# EAGLE schematic rotaryEnc (EAGLE 9.1.2)
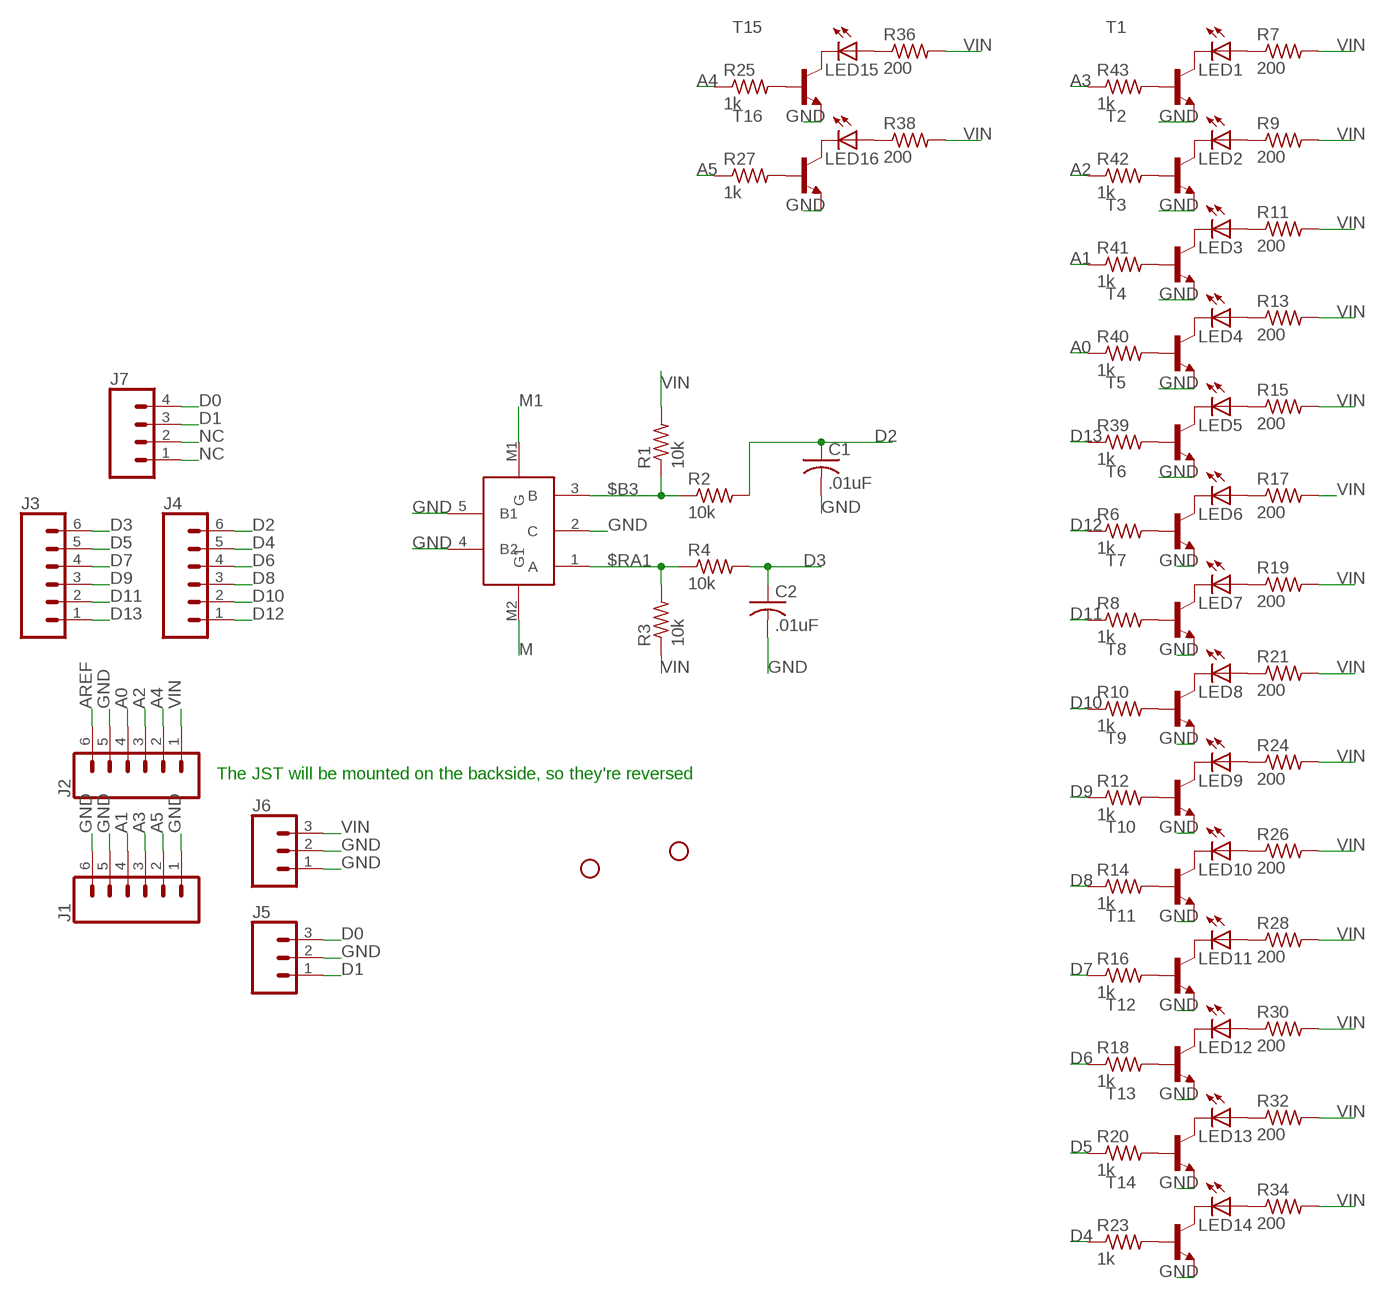
[diagram p0: schematic, sheet 1]

## Parts
C1  .01uF  C-USC1206K  [C1206K]
C2  .01uF  C-USC1206K  [C1206K]
H1  STAND-OFF  [STAND-OFF]
H2  STAND-OFF  [STAND-OFF]
J1  CONN_061.27MM  [1X06_1.27MM]
J2  CONN_061.27MM  [1X06_1.27MM]
J3  CONN_061.27MM  [1X06_1.27MM]
J4  CONN_061.27MM  [1X06_1.27MM]
J5  CONN_03JST-PTH-VERT  [JST-3-PTH-VERT]
J6  CONN_03JST-PTH-VERT  [JST-3-PTH-VERT]
J7  CONN_041.27MM  [1X04_1.27MM]
LED1  LEDCHIP-LED0805  [CHIP-LED0805]
LED2  LEDCHIP-LED0805  [CHIP-LED0805]
LED3  LEDCHIP-LED0805  [CHIP-LED0805]
LED4  LEDCHIP-LED0805  [CHIP-LED0805]
LED5  LEDCHIP-LED0805  [CHIP-LED0805]
LED6  LEDCHIP-LED0805  [CHIP-LED0805]
LED7  LEDCHIP-LED0805  [CHIP-LED0805]
LED8  LEDCHIP-LED0805  [CHIP-LED0805]
LED9  LEDCHIP-LED0805  [CHIP-LED0805]
LED10  LEDCHIP-LED0805  [CHIP-LED0805]
LED11  LEDCHIP-LED0805  [CHIP-LED0805]
LED12  LEDCHIP-LED0805  [CHIP-LED0805]
LED13  LEDCHIP-LED0805  [CHIP-LED0805]
LED14  LEDCHIP-LED0805  [CHIP-LED0805]
LED15  LEDCHIP-LED0805  [CHIP-LED0805]
LED16  LEDCHIP-LED0805  [CHIP-LED0805]
R1  10k  R-US_R0805  [R0805]
R2  10k  R-US_R0805  [R0805]
R3  10k  R-US_R0805  [R0805]
R4  10k  R-US_R0805  [R0805]
R6  1k  R-US_R0805  [R0805]
R7  200  R-US_R0805  [R0805]
R8  1k  R-US_R0805  [R0805]
R9  200  R-US_R0805  [R0805]
R10  1k  R-US_R0805  [R0805]
R11  200  R-US_R0805  [R0805]
R12  1k  R-US_R0805  [R0805]
R13  200  R-US_R0805  [R0805]
R14  1k  R-US_R0805  [R0805]
R15  200  R-US_R0805  [R0805]
R16  1k  R-US_R0805  [R0805]
R17  200  R-US_R0805  [R0805]
R18  1k  R-US_R0805  [R0805]
R19  200  R-US_R0805  [R0805]
R20  1k  R-US_R0805  [R0805]
R21  200  R-US_R0805  [R0805]
R23  1k  R-US_R0805  [R0805]
R24  200  R-US_R0805  [R0805]
R25  1k  R-US_R0805  [R0805]
R26  200  R-US_R0805  [R0805]
R27  1k  R-US_R0805  [R0805]
R28  200  R-US_R0805  [R0805]
R30  200  R-US_R0805  [R0805]
R32  200  R-US_R0805  [R0805]
R34  200  R-US_R0805  [R0805]
R36  200  R-US_R0805  [R0805]
R38  200  R-US_R0805  [R0805]
R39  1k  R-US_R0805  [R0805]
R40  1k  R-US_R0805  [R0805]
R41  1k  R-US_R0805  [R0805]
R42  1k  R-US_R0805  [R0805]
R43  1k  R-US_R0805  [R0805]
T1  BCX56-NPN-SOT89-BCE  [SOT89-BCE]
T2  BCX56-NPN-SOT89-BCE  [SOT89-BCE]
T3  BCX56-NPN-SOT89-BCE  [SOT89-BCE]
T4  BCX56-NPN-SOT89-BCE  [SOT89-BCE]
T5  BCX56-NPN-SOT89-BCE  [SOT89-BCE]
T6  BCX56-NPN-SOT89-BCE  [SOT89-BCE]
T7  BCX56-NPN-SOT89-BCE  [SOT89-BCE]
T8  BCX56-NPN-SOT89-BCE  [SOT89-BCE]
T9  BCX56-NPN-SOT89-BCE  [SOT89-BCE]
T10  BCX56-NPN-SOT89-BCE  [SOT89-BCE]
T11  BCX56-NPN-SOT89-BCE  [SOT89-BCE]
T12  BCX56-NPN-SOT89-BCE  [SOT89-BCE]
T13  BCX56-NPN-SOT89-BCE  [SOT89-BCE]
T14  BCX56-NPN-SOT89-BCE  [SOT89-BCE]
T15  BCX56-NPN-SOT89-BCE  [SOT89-BCE]
T16  BCX56-NPN-SOT89-BCE  [SOT89-BCE]
U$1  EC11  [EC12]

## Nets
$B3: R1.1 R2.1 U$1.3(B)
$RA1: R3.2 R4.1 U$1.1(A)
A0: J2.4 R40.1
A1: J1.4 R41.1
A2: J2.3 R42.1
A3: J1.3 R43.1
A4: J2.2 R25.1
A5: J1.2 R27.1
AREF: J2.6
D0: J5.3 J7.4
D1: J5.1 J7.3
D2: C1.1 J4.6 R2.2
D3: C2.1 J3.6 R4.2
D4: J4.5 R23.1
D5: J3.5 R20.1
D6: J4.4 R18.1
D7: J3.4 R16.1
D8: J4.3 R14.1
D9: J3.3 R12.1
D10: J4.2 R10.1
D11: J3.2 R8.1
D12: J4.1 R6.1
D13: J3.1 R39.1
GND: C1.2 C2.2 J1.1 J1.5 J1.6 J2.5 J5.2 J6.1 J6.2 T1.E T2.E T3.E T4.E T5.E T6.E T7.E T8.E T9.E T10.E T11.E T12.E T13.E T14.E T15.E T16.E U$1.2(C) U$1.4(B2) U$1.5(B1)
M: U$1.M2(G1)
M1: U$1.M1(G)
N$5: R43.2 T1.B
N$6: LED1.C T1.C
N$7: LED1.A R7.1
N$8: LED2.C T2.C
N$9: LED2.A R9.1
N$10: R42.2 T2.B
N$11: LED3.C T3.C
N$12: LED3.A R11.1
N$13: R41.2 T3.B
N$14: LED4.C T4.C
N$15: LED4.A R13.1
N$16: R40.2 T4.B
N$17: LED5.C T5.C
N$18: LED5.A R15.1
N$19: R39.2 T5.B
N$20: LED6.C T6.C
N$21: LED6.A R17.1
N$22: R6.2 T6.B
N$23: LED7.C T7.C
N$24: LED7.A R19.1
N$25: R8.2 T7.B
N$26: LED8.C T8.C
N$27: LED8.A R21.1
N$28: R10.2 T8.B
N$29: LED9.C T9.C
N$30: LED9.A R24.1
N$31: R12.2 T9.B
N$32: LED10.C T10.C
N$33: LED10.A R26.1
N$34: R14.2 T10.B
N$35: LED11.C T11.C
N$36: LED11.A R28.1
N$37: R16.2 T11.B
N$38: LED12.C T12.C
N$39: LED12.A R30.1
N$40: R18.2 T12.B
N$41: LED13.C T13.C
N$42: LED13.A R32.1
N$43: R20.2 T13.B
N$44: LED14.C T14.C
N$45: LED14.A R34.1
N$46: R23.2 T14.B
N$47: LED15.C T15.C
N$48: LED15.A R36.1
N$49: R25.2 T15.B
N$50: LED16.C T16.C
N$51: LED16.A R38.1
N$52: R27.2 T16.B
NC: J7.1 J7.2
VIN: J2.1 J6.3 R1.2 R3.1 R7.2 R9.2 R11.2 R13.2 R15.2 R17.2 R19.2 R21.2 R24.2 R26.2 R28.2 R30.2 R32.2 R34.2 R36.2 R38.2

## Notes on the sheet
- The JST will be mounted on the backside, so they're reversed

## Library data of the parts
C1 C2 = rcl:C-US: CAPACITOR, American symbol; SPICEPREFIX: C
H1 H2 = SparkFun-Hardware:STAND-OFF: Stand Off Drill holes for mechanically mounting via screws, standoffs, etc. Note: Use the keepout ring to avoid running the screw head into surrounding components. Variant Overviews STAND-OFF - Mechanical footprint for a #4 phillips button head screw. STAND-OFF-TIGHT - Mechanical footprint for a #4 phillips button head screw, Example SparkFun Products Screw - Phillips Head (1/4", 4-40, 10 pack) <https://www.sparkfun.com/products/10453> (PRT-10453) Screw - Phillips Head (1/2", 4-40, 10 pack) <https://www.sparkfun.com/products/10452> (PRT-10452) Screw - Phillips Head (3/4", 4-40, 10 pack) <https://www.sparkfun.com/products/10451> (PRT-10451) Screw - Phillips Head (1", 4-40, 10 pack) <https://www.sparkfun.com/products/10450> (PRT-10450)
J1-J4 = SparkFun-Connectors:CONN_06: Multi connection point. Often used as Generic Header-pin footprint for 0.1 inch spaced/style header connections On any of the 0.1 inch spaced packages, you can populate with these: Break Away Headers - Straight <https://www.sparkfun.com/products/116> (PRT-00116) Break Away Male Headers - Right Angle <https://www.sparkfun.com/products/553> (PRT-00553) Female Headers <https://www.sparkfun.com/products/115> (PRT-00115) Break Away Headers - Machine Pin <https://www.sparkfun.com/products/117> (PRT-00117) Break Away Female Headers - Swiss Machine Pin <https://www.sparkfun.com/products/743> (PRT-00743) Arduino Stackable Header - 6 Pin <https://www.sparkfun.com/products/9280> (PRT-09280) For SCREWTERMINALS and SPRING TERMINALS visit here: Screw Terimnals on SparkFun.com <https://www.sparkfun.com/search/results?term=Screw+Terminals> (5mm/3.5mm/2.54mm spacing) This device is also useful as a general connection point to wire up your design to another part of your project. Our various solder wires solder well into these plated through hole pads. Hook-Up Wire - Assortment (Stranded, 22 AWG) <https://www.sparkfun.com/products/11375> (PRT-11375) Hook-Up Wire - Assortment (Solid Core, 22 AWG) <https://www.sparkfun.com/products/11367> (PRT-11367) View the entire wire category on our website here <https://www.sparkfun.com/categories/141>
J5 J6 = SparkFun-Connectors:CONN_03: Multi connection point. Often used as Generic Header-pin footprint for 0.1 inch spaced/style header connections On any of the 0.1 inch spaced packages, you can populate with these: Break Away Headers - Straight <https://www.sparkfun.com/products/116> (PRT-00116) Break Away Male Headers - Right Angle <https://www.sparkfun.com/products/553> (PRT-00553) Female Headers <https://www.sparkfun.com/products/115> (PRT-00115) Break Away Headers - Machine Pin <https://www.sparkfun.com/products/117> (PRT-00117) Break Away Female Headers - Swiss Machine Pin <https://www.sparkfun.com/products/743> (PRT-00743) Stackable Header - 3 Pin (Female, 0.1") <https://www.sparkfun.com/products/13875> (PRT-13875) For SCREWTERMINALS and SPRING TERMINALS visit here: Screw Terimnals on SparkFun.com <https://www.sparkfun.com/search/results?term=Screw+Terminals> (5mm/3.5mm/2.54mm spacing) This device is also useful as a general connection point to wire up your design to another part of your project. Our various solder wires solder well into these plated through hole pads. Hook-Up Wire - Assortment (Stranded, 22 AWG) <https://www.sparkfun.com/products/11375> (PRT-11375) Hook-Up Wire - Assortment (Solid Core, 22 AWG) <https://www.sparkfun.com/products/11367> (PRT-11367) View the entire wire category on our website here <https://www.sparkfun.com/categories/141> Special notes: Molex polarized connector foot print use with SKU : PRT-08232 with associated crimp pins and housings.; PROD_ID: CONN-13230
J7 = SparkFun-Connectors:CONN_04: Multi connection point. Often used as Generic Header-pin footprint for 0.1 inch spaced/style header connections On any of the 0.1 inch spaced packages, you can populate with these: Break Away Headers - Straight <https://www.sparkfun.com/products/116> (PRT-00116) Break Away Male Headers - Right Angle <https://www.sparkfun.com/products/553> (PRT-00553) Female Headers <https://www.sparkfun.com/products/115> (PRT-00115) Break Away Headers - Machine Pin <https://www.sparkfun.com/products/117> (PRT-00117) Break Away Female Headers - Swiss Machine Pin <https://www.sparkfun.com/products/743> (PRT-00743) For SCREWTERMINALS and SPRING TERMINALS visit here: Screw Terimnals on SparkFun.com <https://www.sparkfun.com/search/results?term=Screw+Terminals> (5mm/3.5mm/2.54mm spacing) This device is also useful as a general connection point to wire up your design to another part of your project. Our various solder wires solder well into these plated through hole pads. Hook-Up Wire - Assortment (Stranded, 22 AWG) <https://www.sparkfun.com/products/11375> (PRT-11375) Hook-Up Wire - Assortment (Solid Core, 22 AWG) <https://www.sparkfun.com/products/11367> (PRT-11367) View the entire wire category on our website here <https://www.sparkfun.com/categories/141> Special notes: Molex polarized connector foot print use with SKU : PRT-08231 with associated crimp pins and housings. 1MM SMD Version SKU: PRT-10208
LED1-LED16 = led:LED: LED OSRAM: - CHIPLED LG R971, LG N971, LY N971, LG Q971, LY Q971, LO R971, LY R971 LH N974, LH R974 LS Q976, LO Q976, LY Q976 LO Q996 - Hyper CHIPLED LW Q18S LB Q993, LB Q99A, LB R99A - SideLED LS A670, LO A670, LY A670, LG A670, LP A670 LB A673, LV A673, LT A673, LW A673 LH A674 LY A675 LS A676, LA A676, LO A676, LY A676, LW A676 LS A679, LY A679, LG A679 - Hyper Micro SIDELED® LS Y876, LA Y876, LO Y876, LY Y876 LT Y87S - SmartLED LW L88C, LW L88S LB L89C, LB L89S, LG L890 LS L89K, LO L89K, LY L89K LS L896, LA L896, LO L896, LY L896 - TOPLED LS T670, LO T670, LY T670, LG T670, LP T670 LSG T670, LSP T670, LSY T670, LOP T670, LYG T670 LG T671, LOG T671, LSG T671 LB T673, LV T673, LT T673, LW T673 LH T674 LS T676, LA T676, LO T676, LY T676, LB T676, LH T676, LSB T676, LW T676 LB T67C, LV T67C, LT T67C, LS T67K, LO T67K, LY T67K, LW E67C LS E67B, LA E67B, LO E67B, LY E67B, LB E67C, LV E67C, LT E67C LW T67C LS T679, LY T679, LG T679 LS T770, LO T770, LY T770, LG T770, LP T770 LB T773, LV T773, LT T773, LW T773 LH T774 LS E675, LA E675, LY E675, LS T675 LS T776, LA T776, LO T776, LY T776, LB T776 LHGB T686 LT T68C, LB T68C - Hyper Mini TOPLED® LB M676 - Mini TOPLED Santana® LG M470 LS M47K, LO M47K, LY M47K Source: http://www.osram.convergy.de LUXEON: - LUMILED® LXK2-PW12-R00, LXK2-PW12-S00, LXK2-PW14-U00, LXK2-PW14-V00 LXK2-PM12-R00, LXK2-PM12-S00, LXK2-PM14-U00 LXK2-PE12-Q00, LXK2-PE12-R00, LXK2-PE12-S00, LXK2-PE14-T00, LXK2-PE14-U00 LXK2-PB12-K00, LXK2-PB12-L00, LXK2-PB12-M00, LXK2-PB14-N00, LXK2-PB14-P00, LXK2-PB14-Q00 LXK2-PR12-L00, LXK2-PR12-M00, LXK2-PR14-Q00, LXK2-PR14-R00 LXK2-PD12-Q00, LXK2-PD12-R00, LXK2-PD12-S00 LXK2-PH12-R00, LXK2-PH12-S00 LXK2-PL12-P00, LXK2-PL12-Q00, LXK2-PL12-R00 Source: www.luxeon.com KINGBRIGHT: KA-3528ASYC Source: www.kingbright.com
R1-R4 R6-R21 R23-R28 R30 R32 R34 R36 R38-R43 = resistor:R-US_: RESISTOR, American symbol
T1-T16 = transistor-neu-to92:*-NPN-: NPN Transistror
U$1 = rotary-encoder:EC11